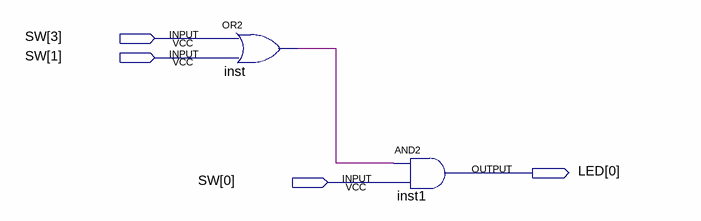
[diagram p0: schematic sheet]
// Quartus schematic ex2.bdf as structural Verilog: 2 symbols, 4 pins
module ex2 (
  input  [3:0] SW,
  output [0:0] LED
);

  wire inst_out;

  or inst (inst_out, SW[3], SW[1]);
  and inst1 (LED[0], inst_out, SW[0]);
endmodule
